# EAGLE design accuphase_e202_rectifier (EAGLE 7.3.0)
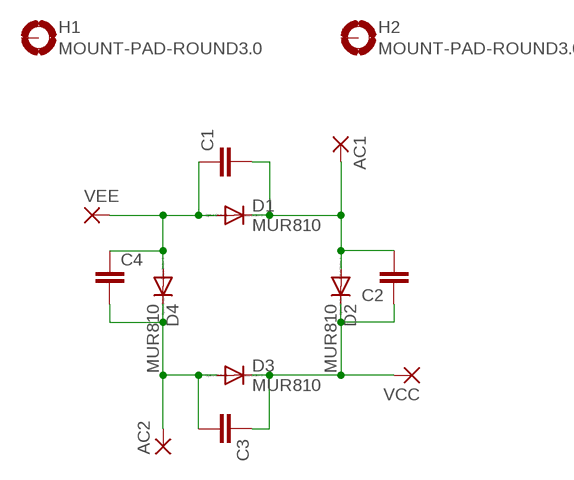
[diagram p0: schematic, sheet 1]

## Parts
AC1  3,81/1,4  [3,81/1,4]
AC2  3,81/1,4  [3,81/1,4]
C1  C-EU075-032X103  [C075-032X103]
C2  C-EU075-032X103  [C075-032X103]
C3  C-EU075-032X103  [C075-032X103]
C4  C-EU075-032X103  [C075-032X103]
D1  MUR810  [TO220ACS]
D2  MUR810  [TO220ACS]
D3  MUR810  [TO220ACS]
D4  MUR810  [TO220ACS]
H1  MOUNT-PAD-ROUND3.0  [3,0-PAD]
H2  MOUNT-PAD-ROUND3.0  [3,0-PAD]
VCC  3,81/1,4  [3,81/1,4]
VEE  3,81/1,4  [3,81/1,4]

## Nets
N$1: AC1.1(P) C1.2 C2.2 D1.C D2.A
N$2: C2.1 C3.1 D2.C D3.C VCC.1(P)
N$3: AC2.1(P) C3.2 C4.2 D3.A D4.C
N$4: C1.1 C4.1 D1.A D4.A VEE.1(P)
Unconnected: H1.B3,0(MOUNT) H2.B3,0(MOUNT)

## Library data of the parts
AC1 AC2 VCC VEE = wirepad:3,81/1,4: THROUGH-HOLE PAD
C1-C4 = resistor:C-EU: CAPACITOR, European symbol
D1-D4 = diode:MUR810: DIODE
H1 H2 = holes:MOUNT-PAD-ROUND: MOUNTING PAD, round

## Board
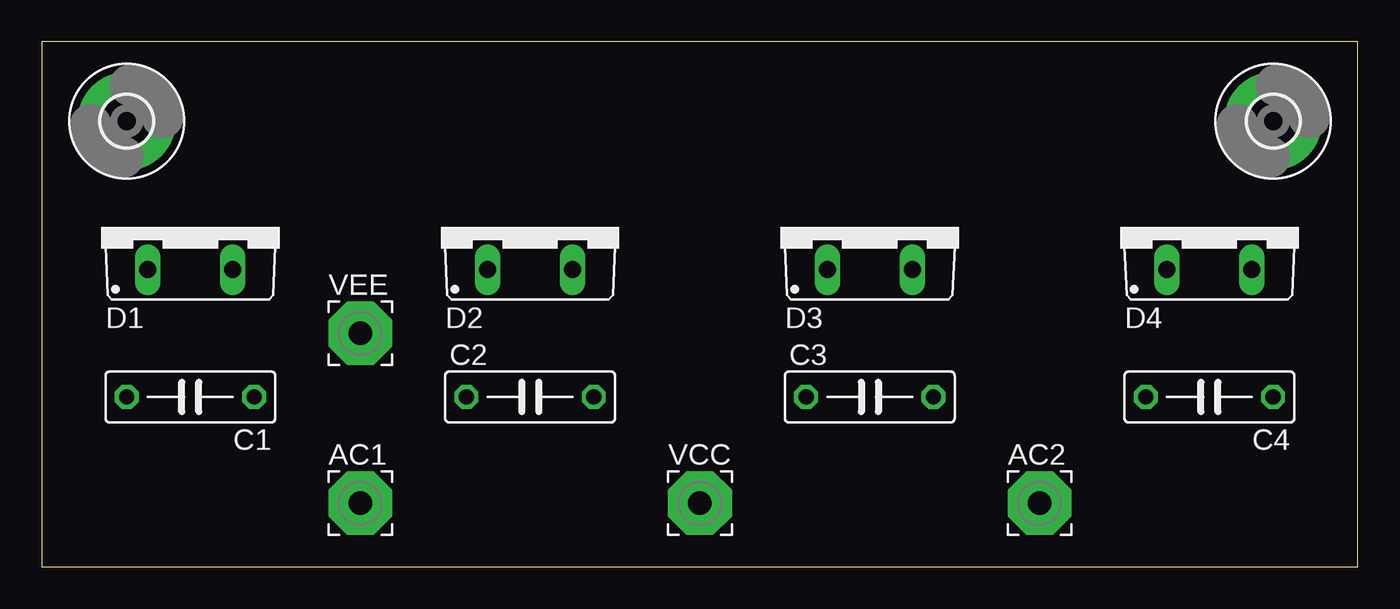
[diagram p1: board, top side]
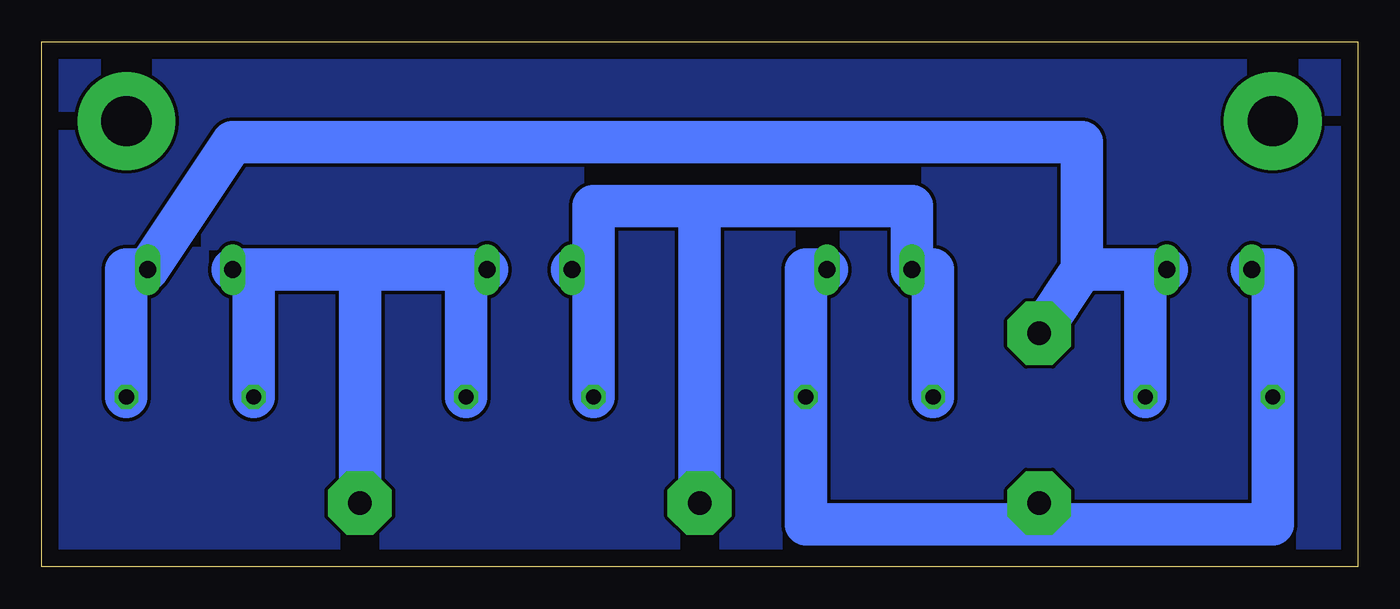
[diagram p2: board, bottom side, seen from below]

Size 78.72 x 31.42 mm. Coordinates in mm from the lower left corner, seen from the top.
Outline: 0,0 78.72,0 78.72,31.42 0,31.42 0,0
Copper layers (1*16): Top 0.035mm / dielectric 1.5mm / Bottom 0.035mm
Design rules "default": minimum track width 10mil, minimum drill 24mil, track to track 8mil, track to pad 8mil, pad to pad 8mil, via to via 8mil, smd to smd 8mil, copper to edge 40mil, drill to drill 8mil, minimum pad ring 10mil, minimum via ring 8mil, stop-mask expansion 4mil, vias tented up to drill 0mil, thermal gap 10mil

### Footprints (pad centres in the part's own frame; a part is rotated, then mirrored left to right if it is on the bottom)
3,81/1,4 = drill 1.397 pad 3.81 octagon: 1 0,0
C075-032X103 = drill 0.914 octagon: 1 -3.81,0; 2 3.81,0
TO220ACS = drill 1.016 long: A 2.54,-2.54; C -2.54,-2.54
3,0-PAD = drill 3 pad 5.842: B3,0 0,0

### Placement (x,y rotation side)
AC1  19.05,3.81 0 top
AC2  59.69,3.81 0 top
C1  8.89,10.16 180 top
C2  29.21,10.16 0 top
C3  49.53,10.16 0 top
C4  69.85,10.16 180 top
D1  8.89,20.32 0 top
D2  29.21,20.32 0 top
D3  49.53,20.32 0 top
D4  69.85,20.32 0 top
H1  73.66,26.67 0 top
H2  5.08,26.67 0 top
VCC  39.37,3.81 0 top
VEE  19.05,13.97 0 top

### Tracks (layer width: path | path; a pad name or v marks a point on that pad's centre or on a via)
N$1
  Bottom 2.54: D2.A 33.02,17.78 C2.2 33.02,2.54 19.05,2.54 | D1.C 5.08,17.78 C1.2 5.08,2.54 19.05,2.54 | AC1.1 19.05,2.54
N$2
  Bottom 2.54: C2.1 25.4,17.78 D2.C 26.67,21.59 39.37,21.59 | C3.1 45.72,17.78 | 45.72,17.78 D3.C | 45.72,17.78 45.72,21.59 39.37,21.59 | VCC.1 39.37,21.59
N$3
  Bottom 2.54: D3.A 53.34,17.78 | 53.34,17.78 C3.2 | C4.2 66.04,17.78 D4.C 59.69,17.78 | AC2.1 59.69,17.78 | 59.69,17.78 53.34,17.78
N$4
  Bottom 2.54: 16.51,17.78 D1.A 12.7,17.78 C1.1 | C4.1 73.66,17.78 D4.A 67.31,25.4 16.51,25.4 16.51,17.78 | 16.51,17.78 VEE.1
N$5
  pour Bottom: 0,0 0,31.75 78.74,31.75 78.74,0